# Altium schematic sheet FPGA_ElCamino_DIGILAB_picoMAX_Dev_Board.SchDoc: Example for ElCamino picoMAX Board
size A; Organization: Altium Limited; Address1: L3, 12a Rodborough Rd; Address2: Frenchs Forest; Address3: NSW; Address4: Australia 2086; DocumentNumber: 1; SheetNumber: 1; SheetTotal: 1
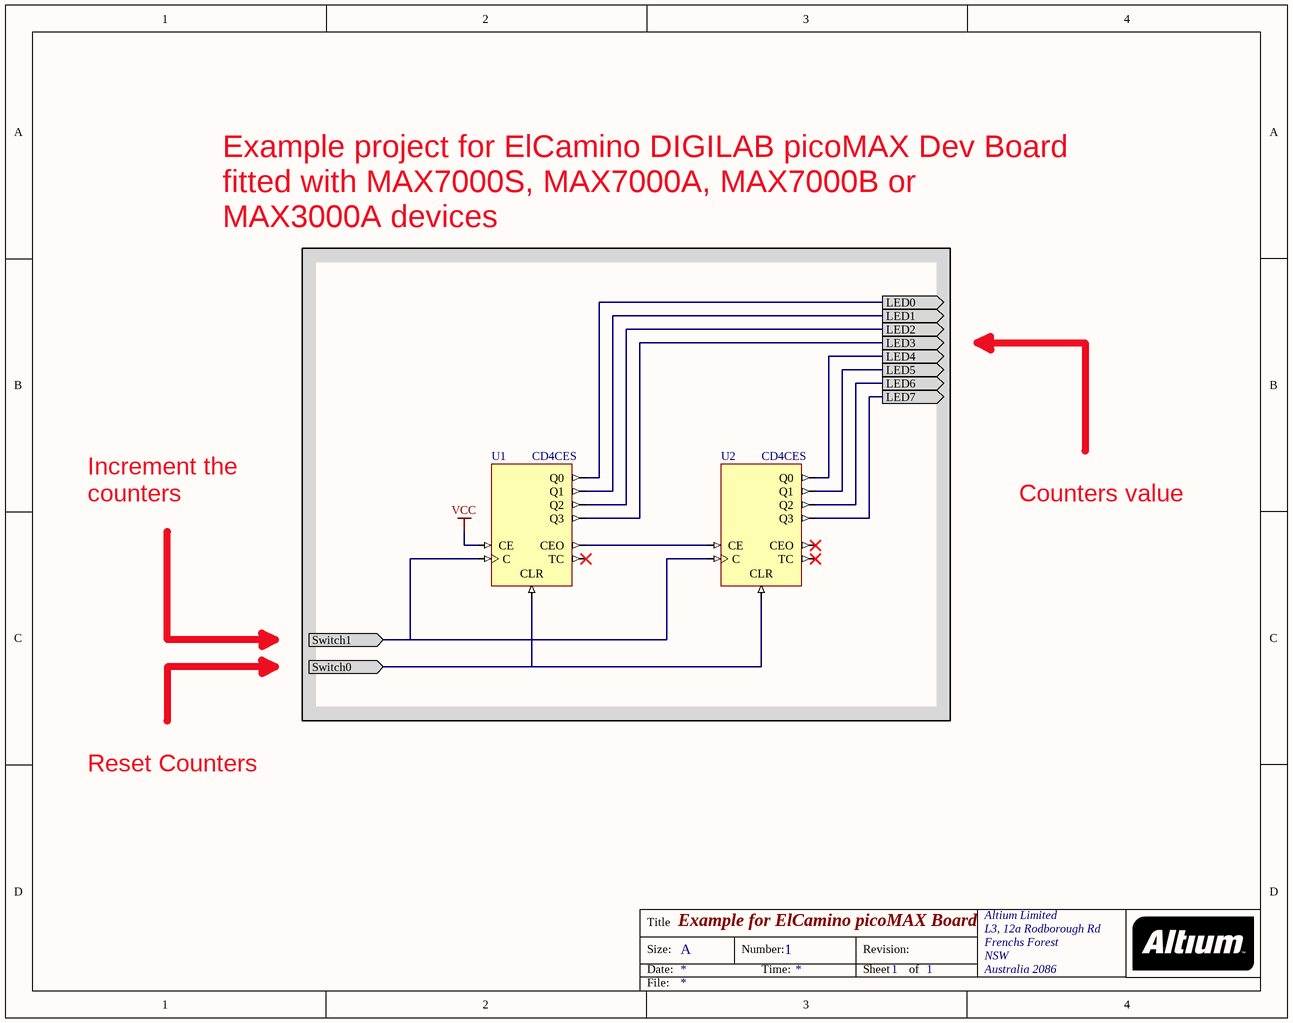
[diagram p0: FPGA_ElCamino_DIGILAB_picoMAX_Dev_Board.SchDoc]

## Parts
U1  CD4CES
U2  CD4CES

## Ports
LED0 (out), LED1 (out), LED2 (out), LED3 (out), LED4 (out), LED5 (out), LED6 (out), LED7 (out), Switch0 (in), Switch1 (in)

## Nets
VCC: U1.CE
LED0: U1.Q0 ; port LED0
LED1: U1.Q1 ; port LED1
LED2: U1.Q2 ; port LED2
LED3: U1.Q3 ; port LED3
LED4: U2.Q0 ; port LED4
LED5: U2.Q1 ; port LED5
LED6: U2.Q2 ; port LED6
LED7: U2.Q3 ; port LED7
Switch0: U1.CLR U2.CLR ; port Switch0
Switch1: U1.C U2.C ; port Switch1
NetU1_CEO: U1.CEO U2.CE

Not connected (* = marked no-connect by the designer): U1 TC*; U2 CEO* TC*

## Notes on the sheet
- Example project for ElCamino DIGILAB picoMAX Dev Board fitted with MAX7000S, MAX7000A, MAX7000B or MAX3000A devices
- Increment the counters
- Counters value
- Reset Counters
- Title
- Size:
- Date:
- A
- Number:
- Time:
- Revision:
- Sheet
- of
- File:

## Library data of the parts
U1 U2 = CD4CES: 4-Bit Cascadable BCD Counter with Clock Enable and Asynchronous Clear, Single Pin Version; Xilinx Equivalent: CD4CE; ArchiveName: GENERIC; Published: 18-Dec-2003; Publisher: Altium Limited; Core Revision: 1.00.00